# Altium schematic sheet USB_ETHERNET_SD.SchDoc
size A; SheetNumber: 5; SheetTotal: 5
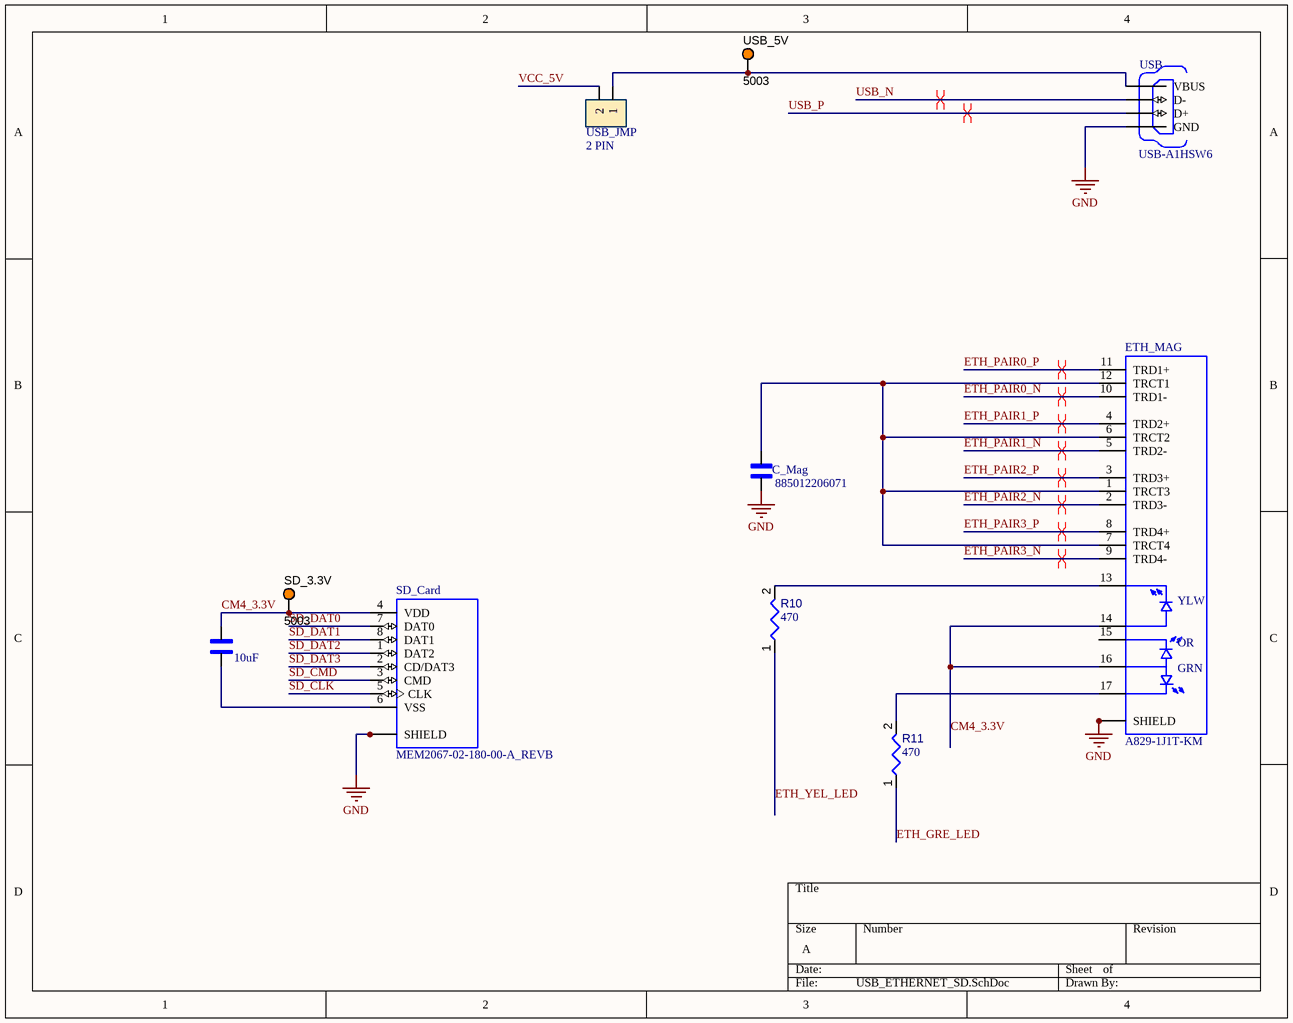
[diagram p0: USB_ETHERNET_SD.SchDoc]

## Parts
?  10uF  [0402_Passive_Capacitor]
C_Mag  885012206071  [WCAP-CSGP_885012206071]
ETH_MAG  A829-1J1T-KM  [BEL_A829-1J1T-KM]
R10  value 470  [RESC2013X50X35ML15T15]  (hidden comment: Resistor 10k +/-1% 0805 125 mW)
R11  value 470  [RESC2013X50X35ML15T15]  (hidden comment: Resistor 10k +/-1% 0805 125 mW)
SD_3.3V  5003  [KSTN-5003]
SD_Card  MEM2067-02-180-00-A_REVB  [GCT_MEM2067-02-180-00-A_REVB]
USB  USB-A1HSW6  [OST_USB-A1HSW6]
USB_5V  5003  [KSTN-5003]
USB_JMP  2 PIN  [2_PIN_100MIL]

## Nets
GND: C_Mag.2 ETH_MAG.S1(SHIELD) ETH_MAG.S2(SHIELD) SD_Card.9(SHIELD) SD_Card.10(SHIELD) SD_Card.11(SHIELD) SD_Card.12(SHIELD) USB.4(GND)
CM4_3.3V: ?.2 ETH_MAG.14 ETH_MAG.16 SD_3.3V.1 SD_Card.4(VDD)
ETH_GRE_LED: R11.1
ETH_PAIR0_N: ETH_MAG.10(TRD1-)
ETH_PAIR0_P: ETH_MAG.11(TRD1+)
ETH_PAIR1_N: ETH_MAG.5(TRD2-)
ETH_PAIR1_P: ETH_MAG.4(TRD2+)
ETH_PAIR2_N: ETH_MAG.2(TRD3-)
ETH_PAIR2_P: ETH_MAG.3(TRD3+)
ETH_PAIR3_N: ETH_MAG.9(TRD4-)
ETH_PAIR3_P: ETH_MAG.8(TRD4+)
ETH_YEL_LED: R10.1
SD_CLK: SD_Card.5(CLK)
SD_CMD: SD_Card.3(CMD)
SD_DAT0: SD_Card.7(DAT0)
SD_DAT1: SD_Card.8(DAT1)
SD_DAT2: SD_Card.1(DAT2)
SD_DAT3: SD_Card.2(CD/DAT3)
USB_N: USB.2(D-)
USB_P: USB.3(D+)
VCC_5V: USB_JMP.2
Net?_1: ?.1 SD_Card.6(VSS)
NetC_Mag_1: C_Mag.1 ETH_MAG.1(TRCT3) ETH_MAG.6(TRCT2) ETH_MAG.7(TRCT4) ETH_MAG.12(TRCT1)
NetETH_MAG_13: ETH_MAG.13 R10.2
NetETH_MAG_17: ETH_MAG.17 R11.2
NetUSB_1: USB.1(VBUS) USB_5V.1 USB_JMP.1

Not connected (* = marked no-connect by the designer): ETH_MAG 15

## Layout directives
differential pair: ETH_PAIR0_N, ETH_PAIR0_P, ETH_PAIR1_N, ETH_PAIR1_P, ETH_PAIR2_N, ETH_PAIR2_P, ETH_PAIR3_N, ETH_PAIR3_P, USB_N, USB_P

## Notes on the sheet
- (in symbol A829-1J1T-KM) YLW; OR; GRN

## Library data of the parts
? = C_10uF_0402: 10uF ±20% 6.3V X5R 0402 Multilayer Ceramic Capacitors MLCC - SMD/SMT RoHS; MFR Part #: CL05A106MQ5NUNC; LCSC Part#: C15525; Datasheet: https://datasheet.lcsc.com/lcsc/1810191215_Samsung-Electro-Mechanics-CL05A106MQ5NUNC_C15525.pdf; Type: Basic; Value: 10uF
C_Mag = 885012206071: WCAP-CSGP General Purpose MLCC; SMT 0603; X7R; 100nF 10%; 25V; -55C to +125C; Tech. PN X7R0603104K025DFCT10000; MF: Wurth Electronics Inc; Package: 0603 Wurth Electronics; Purchase-URL: https://pricing.snapeda.com/search/part/885012206071/?ref=eda; Price: None; Value: *; Availability: Warning; MP: 885012206071; SnapEDA_Link: https://www.snapeda.com/parts/885012206071/Wurth%20Electronics%20Inc/view-part/4217095/?ref=snap
ETH_MAG = A829-1J1T-KM: 1X1 | GIGABIT | Tab Up| Automotive Temperature | Low Profile | With LED; MF: Bel Magnetic Solutions; SnapEDA_Link: https://www.snapeda.com/parts/A829-1J1T-KM/Bel%20Magnetic%20Solutions/view-part/3611988/?ref=snap; Value: *; MP: A829-1J1T-KM; Availability: Warning; Package: None; Price: None; Mouser-Purchase-URL: https://snapeda.com/shop?store=Mouser&id=3611988
R10 R11 = CMP-009-00018-5: Chip Resistor, 10 KOhm, +/- 1%, 125 mW, -55 to 155 degC, 0805 (2012 Metric); Power: 125mW; Voltage Rating: 150V; Tolerance: 1%; Pins: 2; Min Operating Temperature: -55°C; Case/Package: 0805; Max Operating Temperature: 155°C; RoHS Compliant: True; Mounting Technology: SM
SD_3.3V USB_5V = CMP-002-00037-2: Test Point, Orange, Height 4.6 mm, Tail Length 3 mm, 1-Pin THD, RoHS; Manufacturer: Keystone; Colour: Orange; Packaging: Bulk; Package Description: 1-Pin Through Hole Device, Dia 2.54 mm; Pins: 1; Package Reference: 5003; Datasheet Version: Jun-15; Case/Package: 5003; Mounting Technology: TH; Connector Type: TestPoint; Diameter: 2.54mm; Contact Material: Bronze; Datasheet URL: http://keyelco.com/userAssets/file/M65p56.pdf; Manufacturer URL: http://www.keyelco.com/; Package Quantity: 10; Contact Plating: Tin; RoHS Compliant: True
SD_Card = MEM2067-02-180-00-A_REVB: Micro SD Memory Card ConnectorSMT, Hinged, 1.80mm Profile; Price: None; Value: *; MP: MEM2067-02-180-00-A_REVB; Package: None; Availability: Unavailable
USB = USB-A1HSW6: USB-A (USB TYPE-A) - Receptacle Connector 4 Position Through Hole, Right Angle; MF: On Shore; Value: *; SnapEDA_Link: https://www.snapeda.com/parts/USB-A1HSW6/On+Shore+Technology+Inc./view-part/?ref=snap; Purchase-URL: https://pricing.snapeda.com/search/part/USB-A1HSW6/?ref=eda; Availability: In Stock; Price: None; Package: None; Check_prices: https://www.snapeda.com/parts/USB-A1HSW6/On+Shore+Technology+Inc./view-part/?ref=eda; MP: USB-A1HSW6
USB_JMP = JM_2_PIN_MALE: 2.54mm Straight 2 1 Header，Breakaway Through Hole,P=2.54mm Pin Header & Female Header ROHS; MFR Part #: B-2100S02P-A110; Type: Extended; Datasheet: https://datasheet.lcsc.com/lcsc/1811151421_Ckmtw-Shenzhen-Cankemeng-B-2100S02P-A110_C124375.pdf; LCSC Part#: C124375; Value: 2 PIN